# Altium project LM393 Sensor.PrjPcb
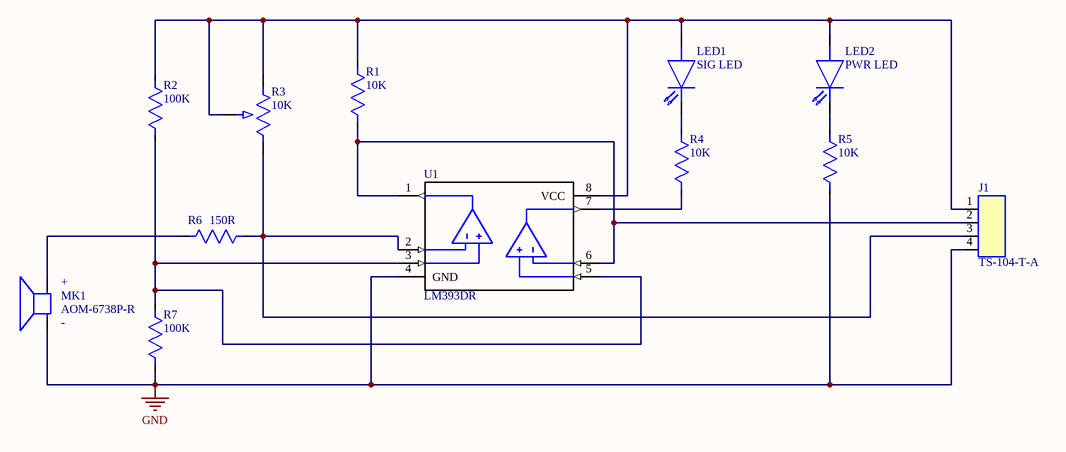
[diagram p0: Sheet1.SchDoc]
1 sheet, 12 parts. Net scope: global (net labels, ports and power ports of the same name join across sheets).
Board file: PCB1.PcbDoc

## Sheet Sheet1.SchDoc
size A; SheetNumber: 1; SheetTotal: 1

### Parts
J1  TS-104-T-A  [TS-104-T-A]
LED1  SIG LED  [CMD15-21VRD/TR8]
LED2  PWR LED  [CMD15-21VRD/TR8]
MK1  AOM-6738P-R  [AOM-6738P-R]
R1  10K  [ERJ-6GEYJ103V]
R2  100K  [RC0805JR-07100KL]
R3  10K  [3296W-1-103LF]
R4  10K  [ERJ-6GEYJ103V]
R5  10K  [ERJ-6GEYJ103V]
R6  150R  [RC0805JR-07150RL]
R7  100K  [RC0805JR-07100KL]
U1  LM393DR  [LM393DR]

### Nets
GND: J1.4 MK1.N(NEG) R5.1 R7.1 U1.4(GND)
NetJ1_1: J1.1 LED1.1 LED2.1 R1.2 R2.2 R3.2 R3.3 U1.8(VCC)
NetJ1_2: J1.2 R1.1 U1.1(OUT1) U1.6(2IN-)
NetJ1_3: J1.3 R3.1 R6.2 U1.2(1IN-)
NetLED1_2: LED1.2 R4.2
NetLED2_2: LED2.2 R5.2
NetMK1_P: MK1.P(POS) R6.1
NetR2_1: R2.1 R7.2 U1.3(1IN+) U1.5(2IN+)
NetR4_1: R4.1 U1.7(OUT2)

### Notes on the sheet
- (in symbol AOM-6738P-R) +; -

### Library data of the parts
J1 = TS-104-T-A: CONN HEADER VERT 4POS 2.54MM; Mfr_Name: Samtec Inc; RefDes: RefDes; Type: Type
LED1 LED2 = CMD15-21VRDTR8: Red LED Indication - Discrete 1.7V 1206 (3216 Metric); P/N: CMD15-21VRD/TR8
MK1 = AOM-6738P-R: 30 Hz ~ 15 kHz Analog Microphone Electret Condenser 1.5 V ~ 10 V Omnidirectional (-38dB ±3dB) PC Pins; P/N: AOM-6738P-R
R1 R4 R5 = ERJ-6GEYJ103V: 10 kOhms ±5% 0.125W, 1/8W Chip Resistor 0805 (2012 Metric) Automotive AEC-Q200 Thick Film; P/N: ERJ-6GEYJ103V
R2 R7 = RC0805JR-07100KL: 100 kOhms ±5% 0.125W, 1/8W Chip Resistor 0805 (2012 Metric) Moisture Resistant Thick Film; P/N: RC0805JR-07100KL
R3 = 3296W-1-103LF: 10 kOhms 0.5W, 1/2W PC Pins Through Hole Trimmer Potentiometer Cermet 25.0 Turn Top Adjustment; P/N: 3296W-1-103LF
R6 = RC0805JR-07150RL: 150 Ohms ±5% 0.125W, 1/8W Chip Resistor 0805 (2012 Metric) Moisture Resistant Thick Film; P/N: RC0805JR-07150RL
U1 = LM393DR: IC COMPARATOR 2 DIFF 8SOIC; P/N: LM393DR